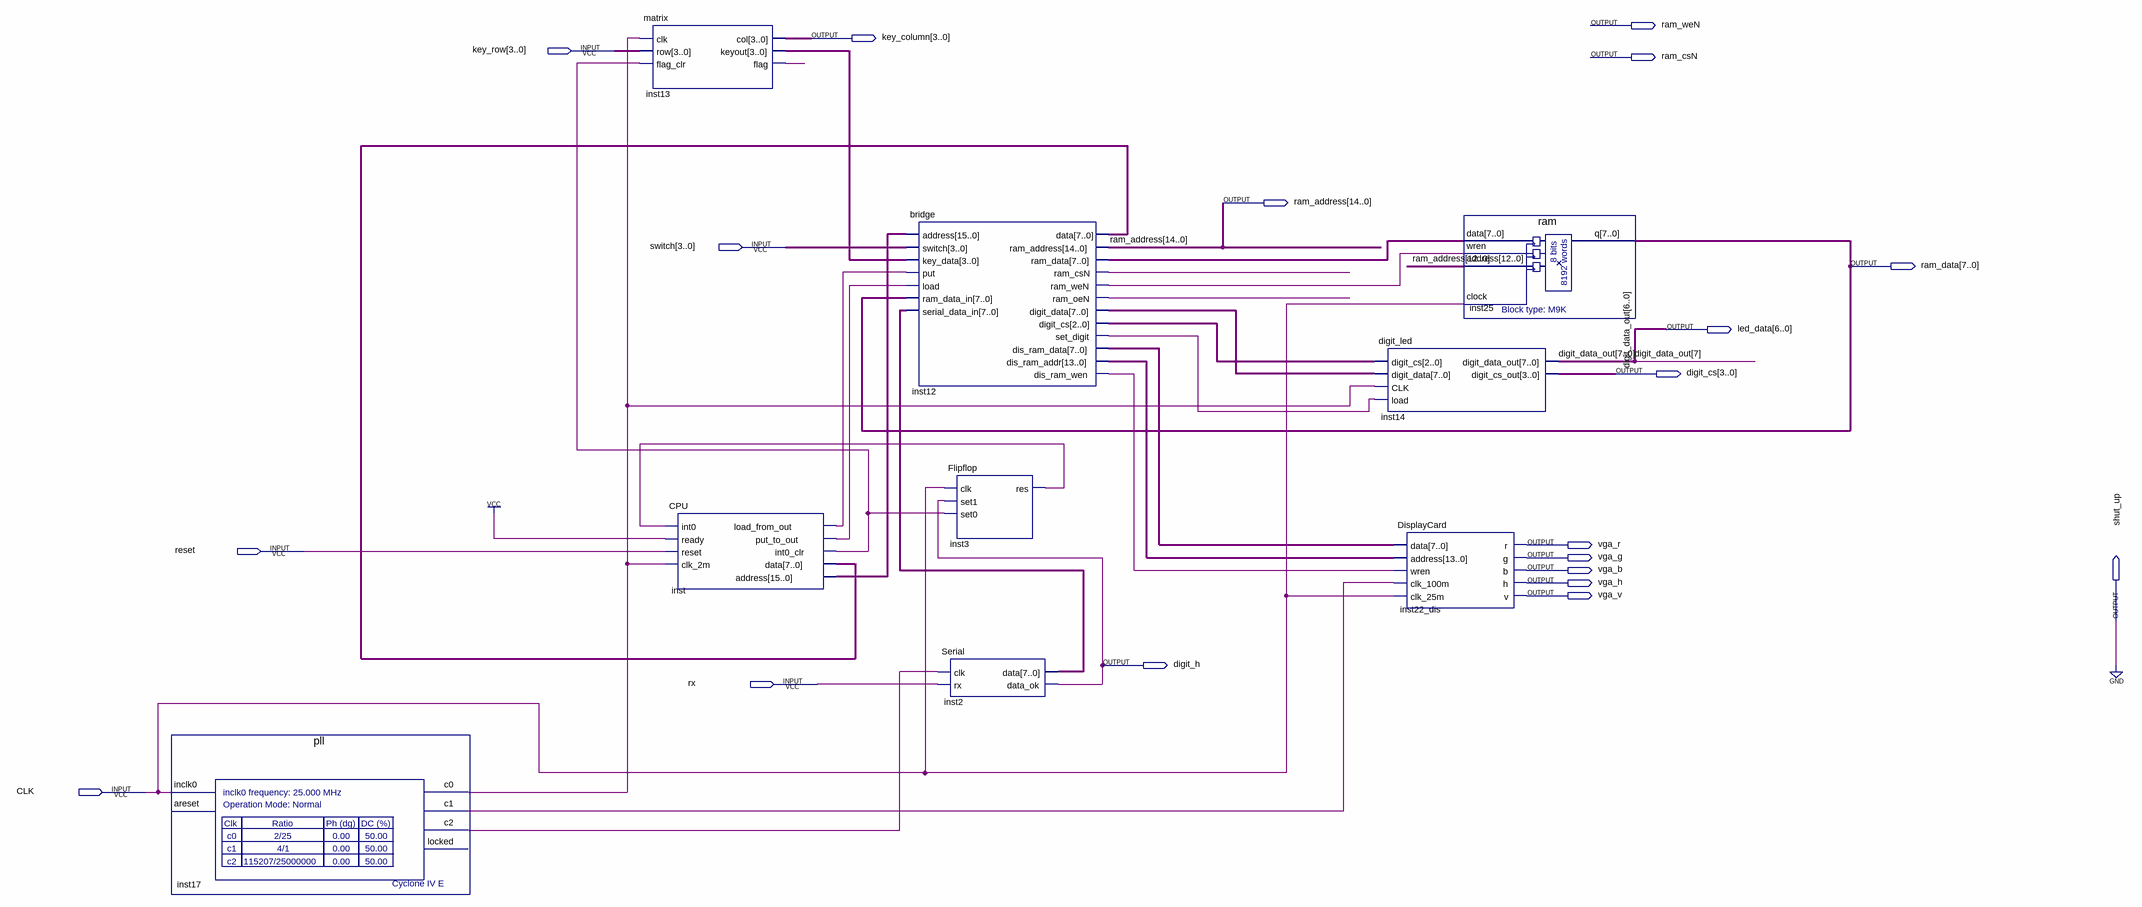
[diagram p0: schematic sheet]
// Quartus schematic SYSTEM.bdf as structural Verilog: 9 symbols, 19 pins
module SYSTEM (
  input  [3:0] key_row,
  input  [3:0] switch,
  input  reset,
  input  rx,
  input  CLK,
  output ram_weN,
  output [3:0] key_column,
  output ram_csN,
  output [14:0] ram_address,
  output [7:0] ram_data,
  output [6:0] led_data,
  output [3:0] digit_cs,
  output vga_r,
  output vga_g,
  output vga_b,
  output vga_h,
  output vga_v,
  output shut_up,
  output digit_h
);

  wire inst3_res, inst12_dis_ram_wen, inst12_ram_csn, inst12_ram_oen, inst12_ram_wen, inst12_set_digit,
       inst13_flag, inst17_c0, inst17_c1, inst17_c2, inst_int0_clr, inst_load_from_out, inst_put_to_out;
  wire [2:0] inst12_digit_cs;
  wire [3:0] inst13_keyout;
  wire [7:0] inst2_data, inst12_digit_data, inst12_dis_ram_data, inst12_ram_data, inst_data;
  wire [7:7] digit_data_out;
  wire [13:0] inst12_dis_ram_addr;
  wire [15:0] inst_address;

  pll inst17 (.inclk0(CLK), .c0(inst17_c0), .c1(inst17_c1), .c2(inst17_c2));  // open: areset, locked
  matrix inst13 (
    .clk(inst17_c0), .row(key_row), .flag_clr(inst_int0_clr), .col(key_column), .keyout(inst13_keyout),
    .flag(inst13_flag));
  CPU inst (
    .int0(inst3_res), .ready(1'b1), .reset(reset), .clk_2m(inst17_c0), .load_from_out(inst_load_from_out),
    .put_to_out(inst_put_to_out), .int0_clr(inst_int0_clr), .address(inst_address), .data(inst_data));
  bridge inst12 (
    .address(inst_address), .switch(switch), .key_data(inst13_keyout), .put(inst_load_from_out),
    .load(inst_put_to_out), .ram_data_in(ram_data), .serial_data_in(inst2_data), .ram_address(ram_address),
    .ram_data(inst12_ram_data), .ram_csN(inst12_ram_csn), .ram_weN(inst12_ram_wen), .ram_oeN(inst12_ram_oen),
    .digit_data(inst12_digit_data), .digit_cs(inst12_digit_cs), .set_digit(inst12_set_digit),
    .dis_ram_data(inst12_dis_ram_data), .dis_ram_addr(inst12_dis_ram_addr), .dis_ram_wen(inst12_dis_ram_wen),
    .data(inst_data));
  Serial inst2 (.clk(inst17_c2), .rx(rx), .data(inst2_data), .data_ok(digit_h));
  Flipflop inst3 (.clk(CLK), .set1(digit_h), .set0(inst_int0_clr), .res(inst3_res));
  digit_led inst14 (
    .digit_cs(inst12_digit_cs), .digit_data(inst12_digit_data), .CLK(inst17_c0), .load(inst12_set_digit),
    .digit_data_out({digit_data_out[7], led_data}), .digit_cs_out(digit_cs));
  DisplayCard inst22_dis (
    .data(inst12_dis_ram_data), .address(inst12_dis_ram_addr), .wren(inst12_dis_ram_wen),
    .clk_100m(inst17_c1), .clk_25m(CLK), .r(vga_r), .g(vga_g), .b(vga_b), .h(vga_h), .v(vga_v));
  ram inst25 (.data(inst12_ram_data), .wren(inst12_ram_wen), .address(ram_address[12:0]), .clock(CLK), .q(ram_data));

  assign shut_up = 1'b0;

  // Other names for the same wires on the sheet: digit_data_out[6:0] = led_data
endmodule
